# EasyEDA Pro project ProProject_Hauptplatine_ESP32.epro, board PCB1_kombi
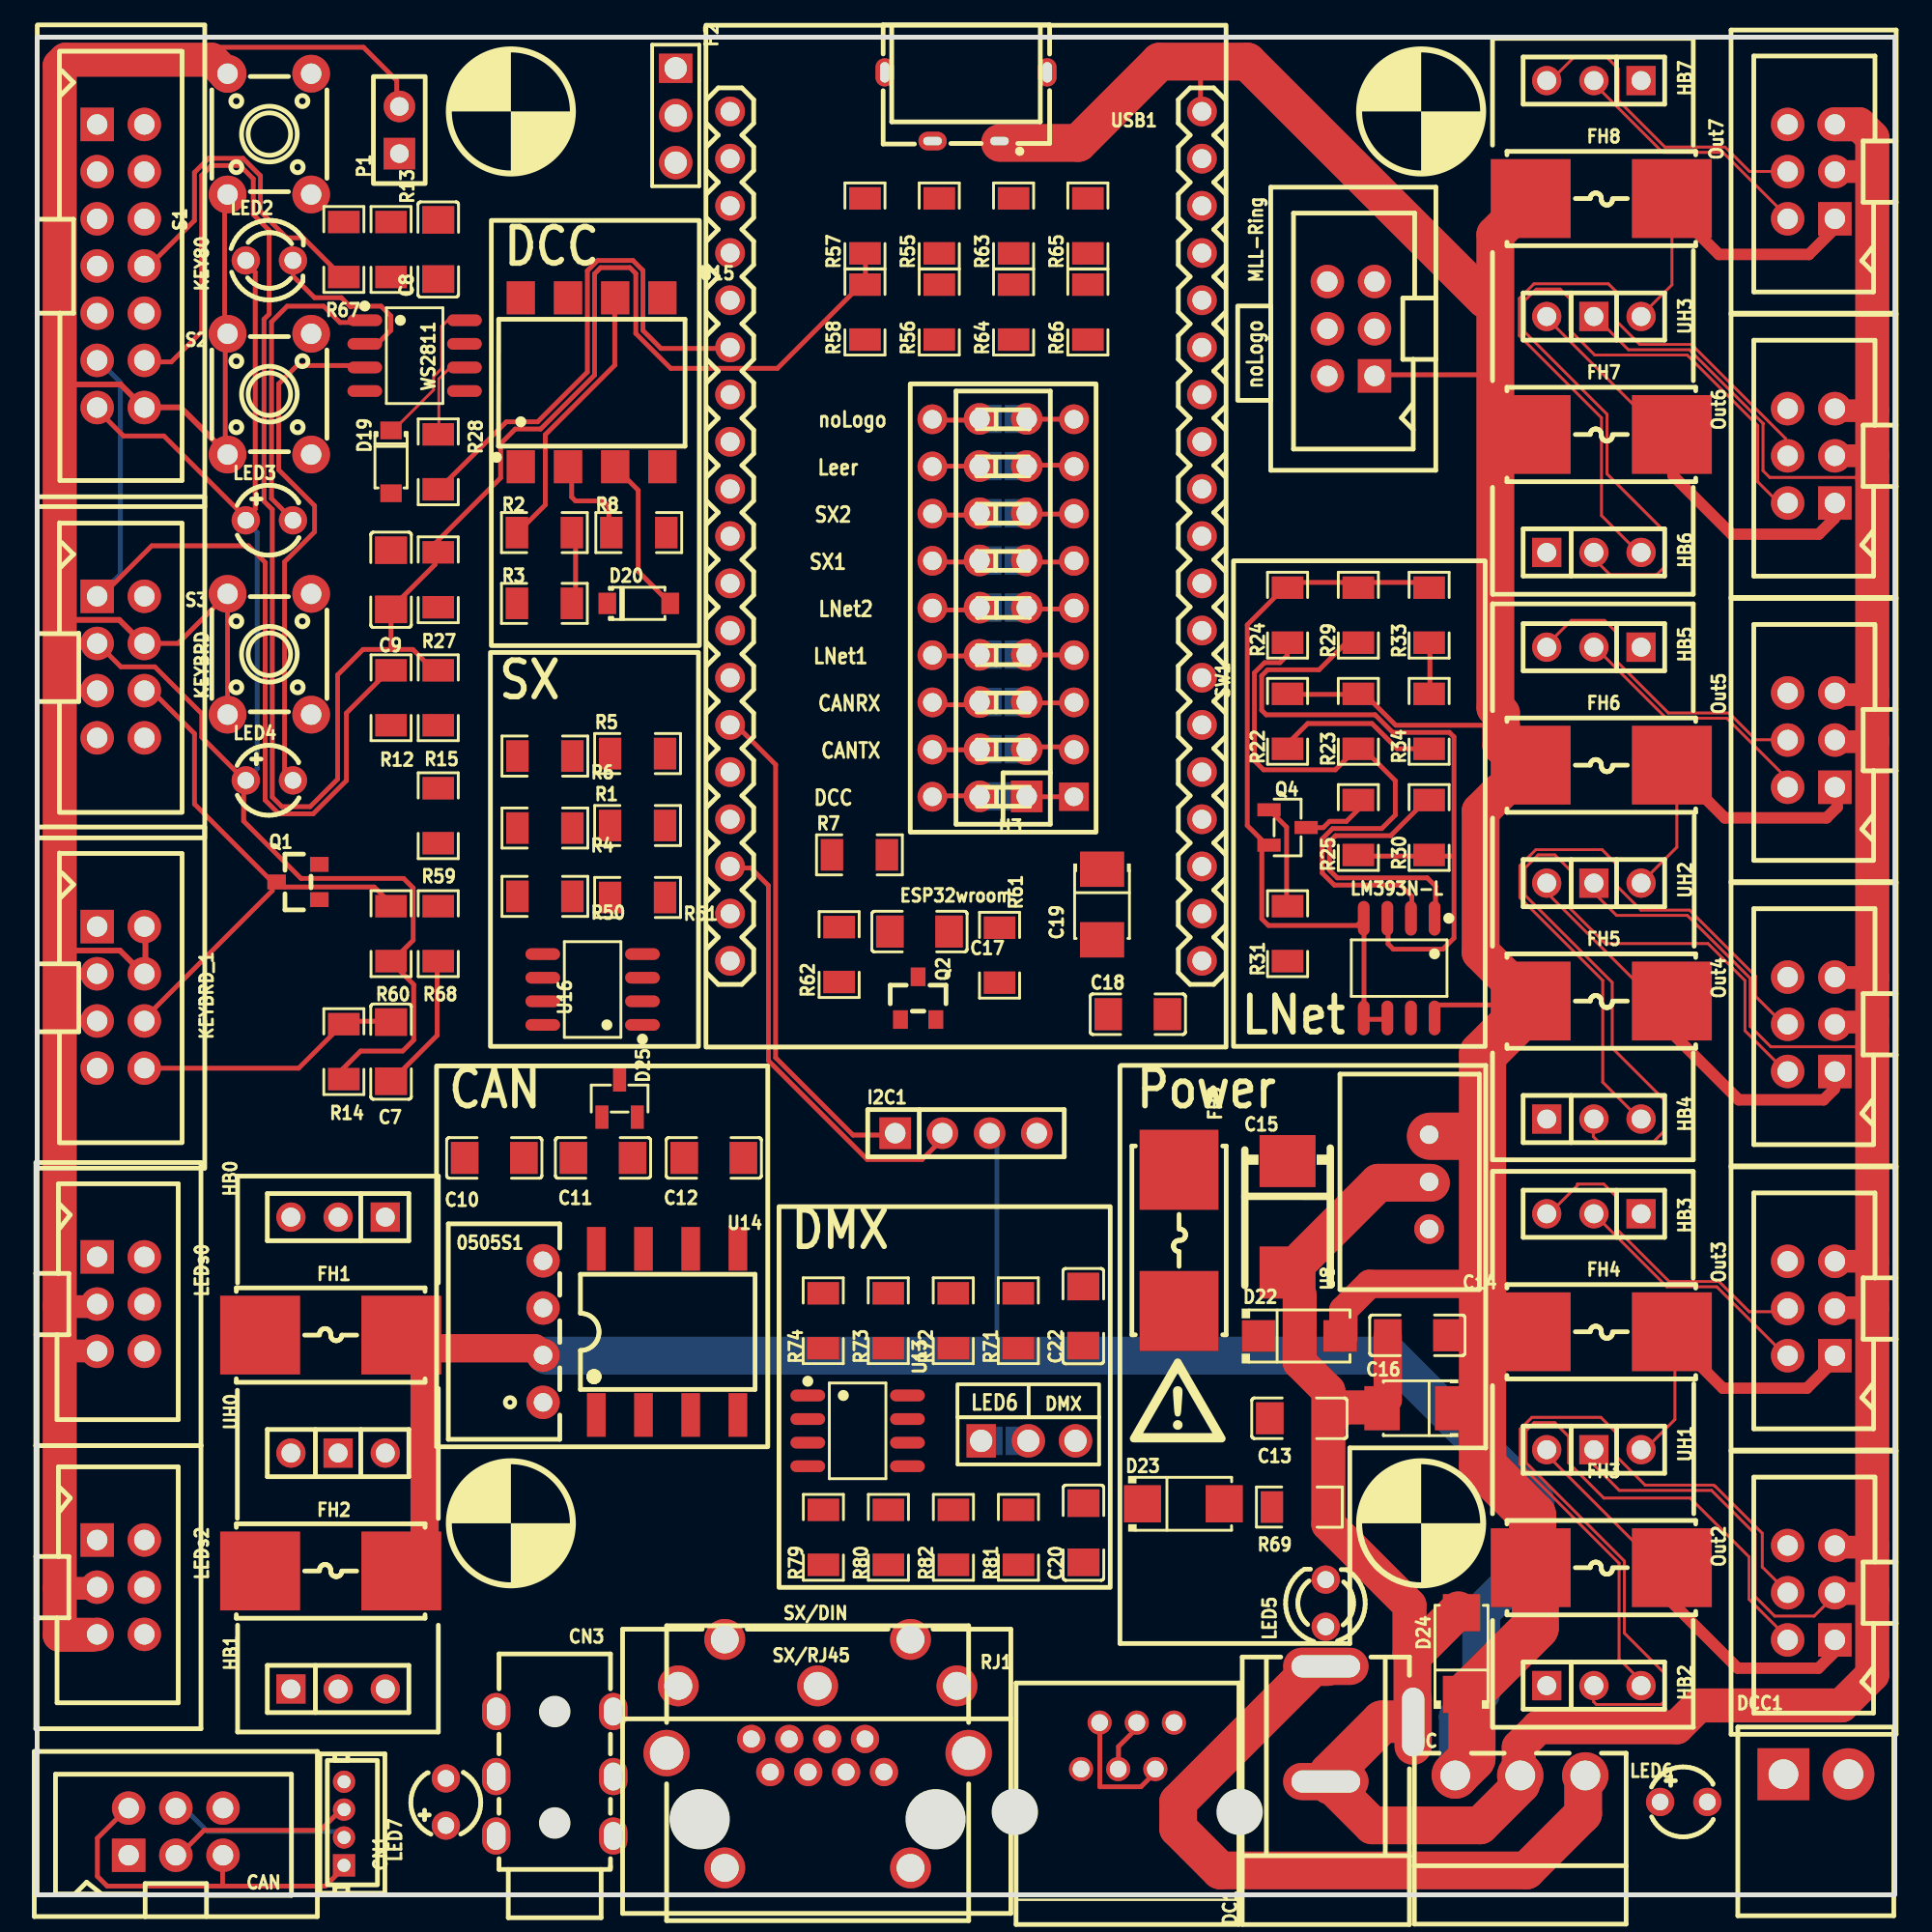
[diagram p14: board, top side]
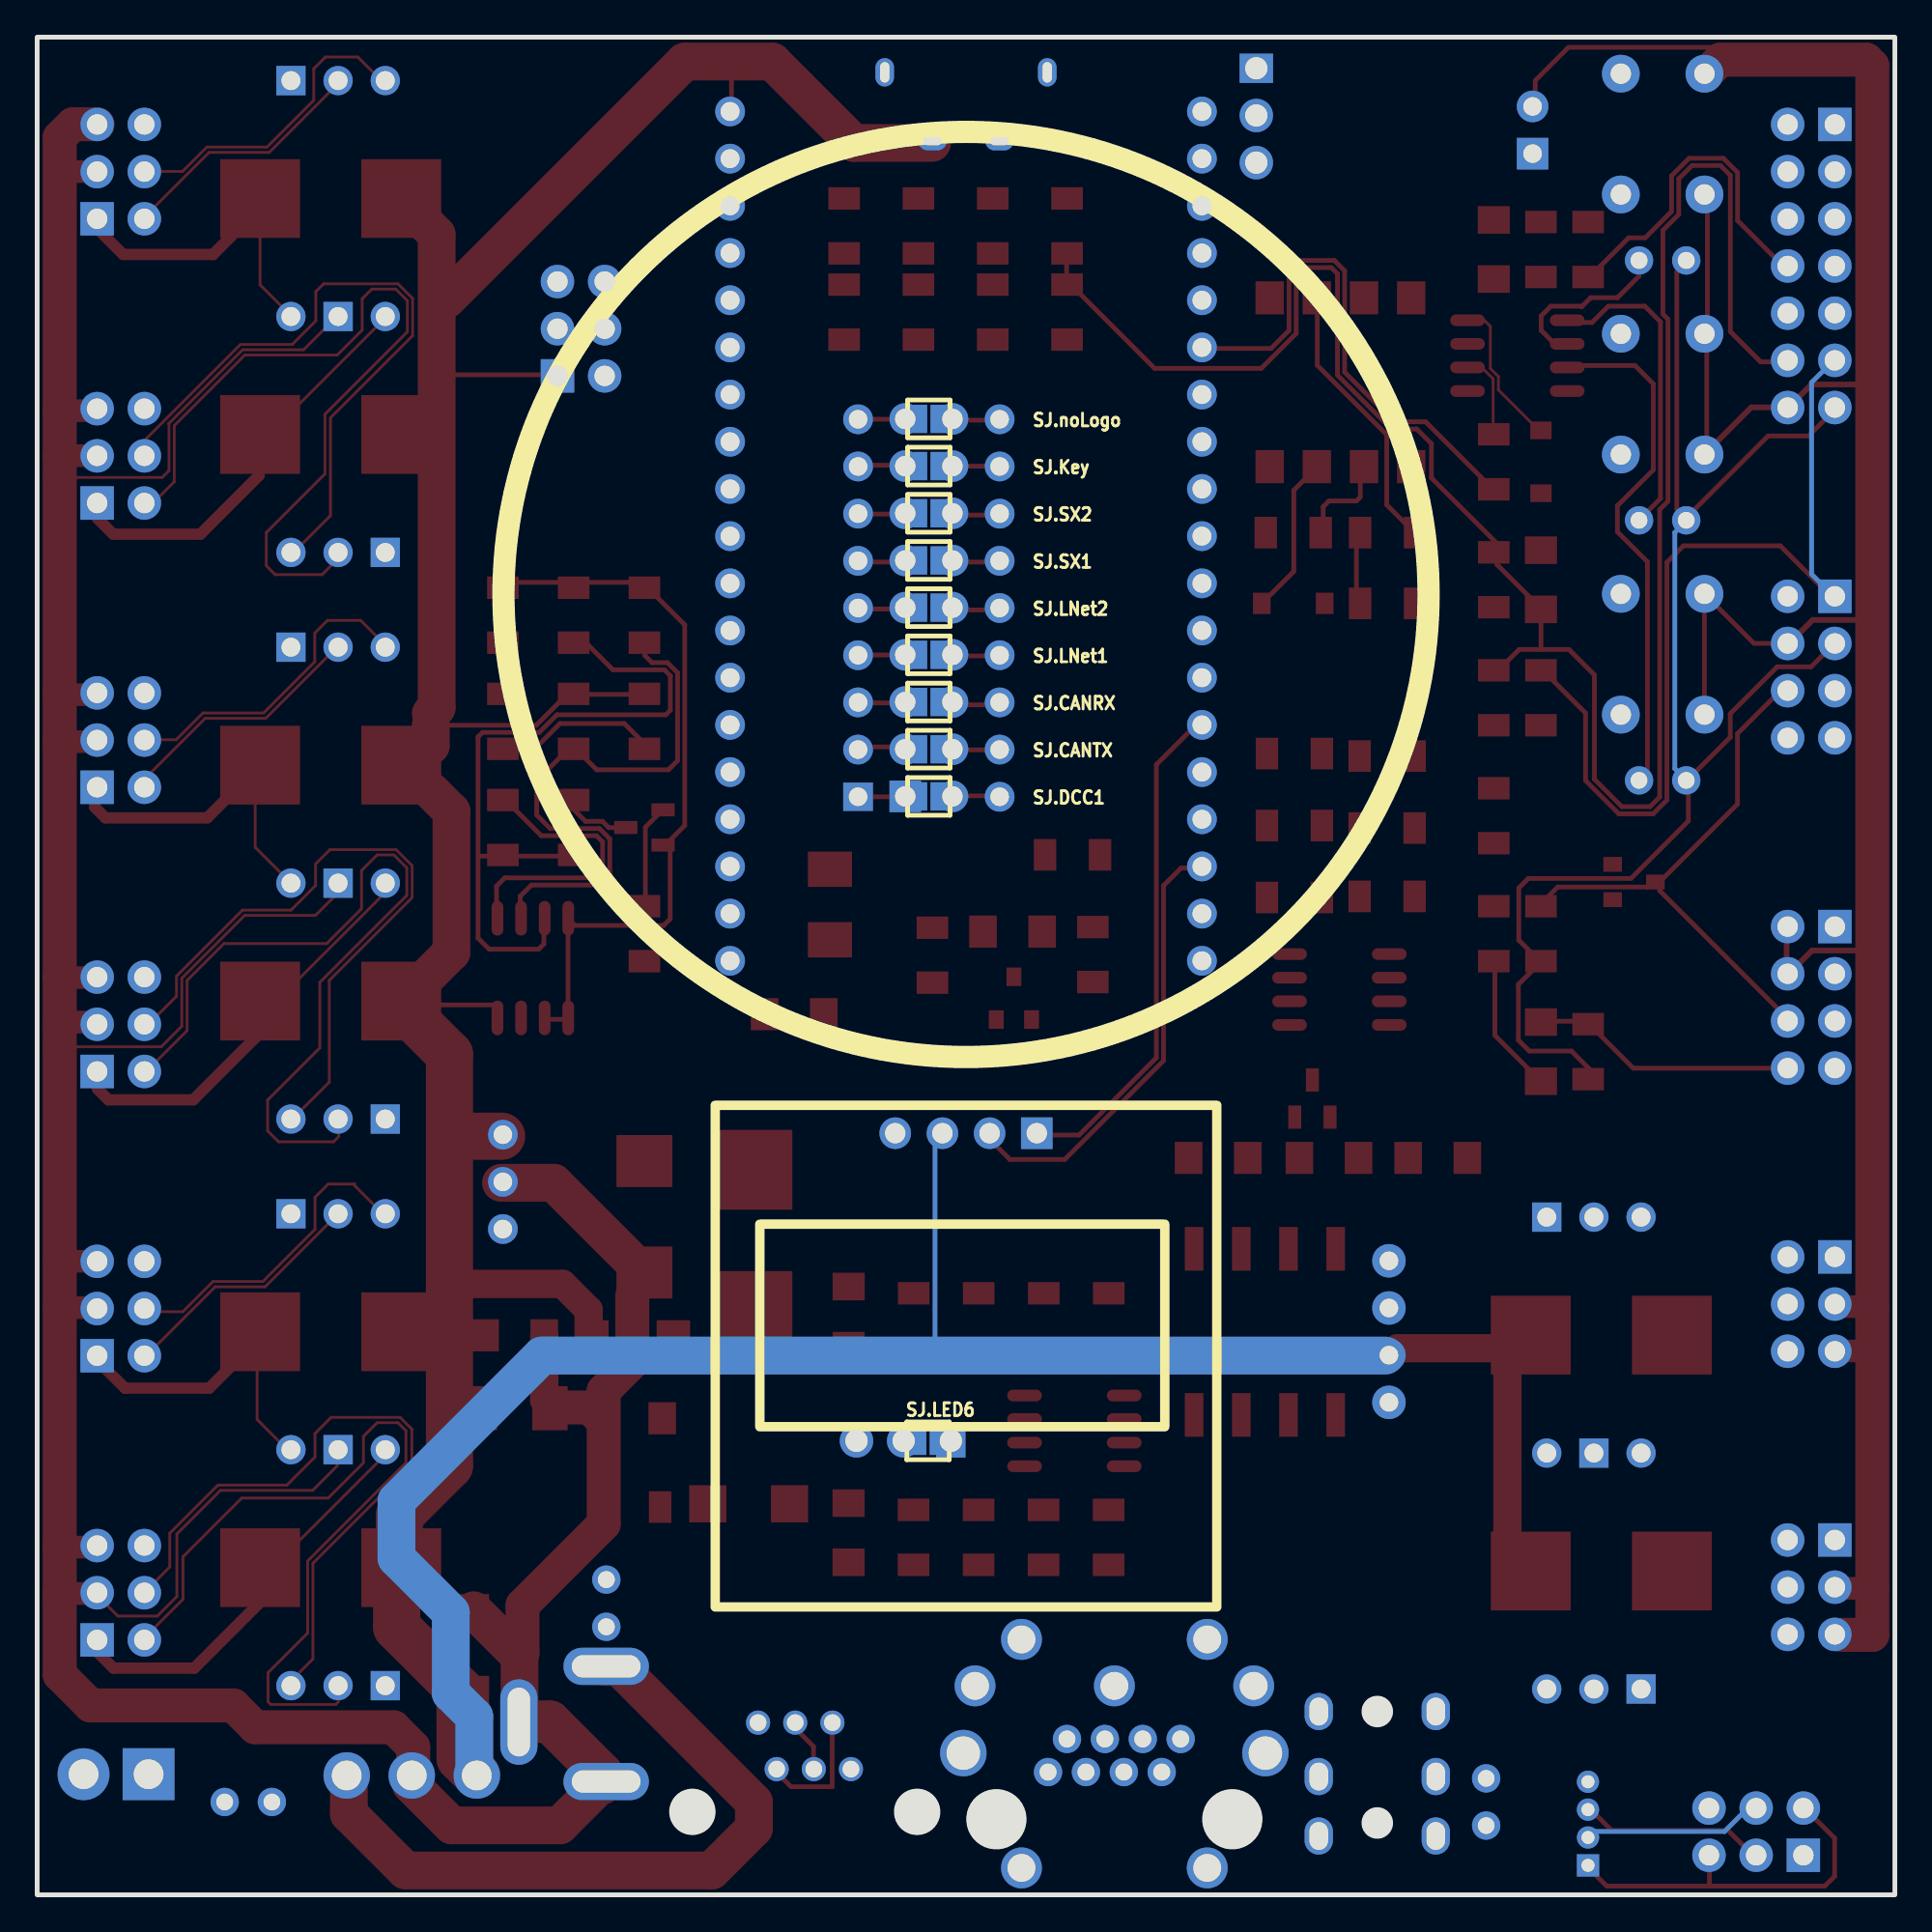
[diagram p15: board, bottom side, seen from below]

Outline 100 x 100 mm; copper layers: Top Layer, Bottom Layer. Coordinates in mm from the lower left corner of the outline.
Outline path: rectangle 0,100 100,0
Stack: Top Layer 0.035mm / Dielectric1 1.51mm FR4 er 4.5 / Bottom Layer 0.035mm

## Design rules (mm)
template: copperThickness1oz
spacing copperThickness1oz (default): track to track 0.132, other pairs 0.152 to 0.3
spacing copperThickness2oz: track to track 0.203, other pairs 0.152 to 0.3
track width copperThickness1oz (default): min 0.127, default 0.254, max 2.54
track width copperThickness2oz: min 0.203, default 0.254, max 2.54
differential pair differentialPair (default): width min 0.127, default 0.254, max 2.54; gap min 0.152, default 0.152
via viaSize (default): diameter min 0.5, default 0.61, max 10; hole min 0.3, default 0.305, max 6.299

## Placement (name value [footprint] x y rotation side)
0505S1  B0505S-W5R3  [PWRM-TH_BXXXXS-1WR3]  27.23 30.32 90 top
C7  1uF  [C1206]  19.05 45.39 90 top
C8  1uF  [C1206]  21.59 88.57 90 top
C9  1uF  [C1206]  19.05 70.79 90 top
C10  4.7uF  [C1206]  24.61 39.67 180 top
C11  4.7uF  [C1206]  30.46 39.67 180 top
C12  100nF  [C1206]  36.42 39.67 180 top
C13  100nF  [C1206]  67.94 25.65 180 top
C14  100nF  [C1206]  74.29 30.12 0 top
C15  100uF  [CASE-D_7343]  67.31 36.5 90 top
C16  100uF  [CAP-SMD_L3.5-W2.8-R-RD]  74.29 26.2 0 top
C17  1uF  [C1206]  47.5 51.85 180 top
C18  100nF  [C1206]  59.25 47.4 0 top
C19  100uF  [CAP-SMD_L3.5-W2.8-R-RD]  57.32 53.31 90 top
C20  1uF  [C1206]  56.32 19.49 90 top
C22  10uF  [C1206]  56.31 31.15 90 top
CAN  BH254V-6P  [IDC-TH_6P-P2.54-V-R2-C3-S2.54]  7.47 3.4 0 top
CN1  B4B-ZR-3.4(LF)(SN)  [CONN-TH_B4B-ZR-3.4-LF-SN]  16.52 3.84 270 top
CN3  PJ-3136-B  [AUDIO-TH_PJ-3136-B]  27.86 6.52 90 top
D19  1N5819W  [SOD-123_L2.8-W1.8-LS3.7-RD]  19.05 77.14 270 top
D20  1N5819W  [SOD-123_L2.8-W1.8-LS3.7-RD]  32.38 69.52 0 top
D22  1N5819  [SMA_L4.4-W2.6-LS5.0-RD]  67.94 30.08 0 top
D23  SS52  [SMA_L4.3-W2.6-LS5.1-R-RD]  61.7 21.05 0 top
D24  SS52  [SMA_L4.3-W2.6-LS5.1-R-RD]  76.67 12.99 90 top
D25  PESD2CAN,215  [SOT-23-3_L2.9-W1.3-P1.90-LS2.4-BR]  31.35 42.86 270 top
DC  DB2ERC-3.5-3P-GN  [CONN-TH_3P-P3.50_DB2ERC-3.5-3P-GN]  79.84 6.43 0 top
DC1  DC005  [DC-IN-TH_DC005]  71.72 9.2 90 top
DCC1  DB2ERC-3.5-2P-GN  [CONN-TH_2P-P3.50_DB2ERC-3.5-2P]  95.75 6.49 0 top
DMX  2.54-1*3P针  [HDR-TH_3P-P2.54-V-M-1]  53.36 24.44 0 top
ESP32wroom  ESP32-DevKitC  [buletm-smd_esp32-devkitc]  50 73.14 90 top
FH1  01550900M  [FUSE-SMD_L9.8-W5.0]  15.8 30.13 180 top
FH2  01550900M  [FUSE-SMD_L9.8-W5.0]  15.8 17.43 180 top
FH3  01550900M  [FUSE-SMD_L9.8-W5.0]  84.2 17.61 0 top
FH4  01550900M  [FUSE-SMD_L9.8-W5.0]  84.2 30.31 0 top
FH5  01550900M  [FUSE-SMD_L9.8-W5.0]  84.2 48.11 0 top
FH6  01550900M  [FUSE-SMD_L9.8-W5.0]  84.2 60.81 0 top
FH7  01550900M  [FUSE-SMD_L9.8-W5.0]  84.2 78.61 0 top
FH8  01550900M  [FUSE-SMD_L9.8-W5.0]  84.2 91.31 0 top
FH9  01550900M  [FUSE-SMD_L9.8-W5.0]  61.47 35.23 90 top
H2  2.54-1*3P针  [HDR-TH_3P-P2.54-V-M-1]  34.37 95.78 270 top
H3  X6521WV-2x09H-C60D30  [hdr-th_18p-p2.54-v-m-r2-c9-s2.54]  52 69.29 90 top
HB0  PM2.54-1*3  [HDR-TH_3P-P2.54-V-F]  16.2 36.48 180 top
HB1  PM2.54-1*3  [HDR-TH_3P-P2.54-V-F]  16.2 11.08 0 top
HB2  PM2.54-1*3  [HDR-TH_3P-P2.54-V-F]  83.8 11.26 0 top
HB3  PM2.54-1*3  [HDR-TH_3P-P2.54-V-F]  83.8 36.66 180 top
HB4  PM2.54-1*3  [HDR-TH_3P-P2.54-V-F]  83.8 41.76 0 top
HB5  PM2.54-1*3  [HDR-TH_3P-P2.54-V-F]  83.8 67.16 180 top
HB6  PM2.54-1*3  [HDR-TH_3P-P2.54-V-F]  83.8 72.26 0 top
HB7  PM2.54-1*3  [HDR-TH_3P-P2.54-V-F]  83.8 97.66 180 top
I2C1  2.54-1*4P母  [HDR-TH_4P-P2.54-V-F]  50 41 0 top
KEY80  KEY80  [IDC-TH_14P-P2.54-V-R2-C7-S2.54]  4.5 87.68 270 top
KEYBRD  KEYBRD  [IDC-TH_8P-P2.54-V-R2-C4-S2.54]  4.5 66.09 270 top
KEYBRD_1  KEYBRD_1  [IDC-TH_8P-P2.54-V-R2-C4-S2.54]  4.5 48.31 270 top
LED2  gelb  [LED-TH_BD3.0-P2.54-FD_YELLOW]  12.5 87.98 0 top
LED3  weiss  [LED-TH_BD3.8-P2.54-FD_WHITE]  12.5 73.99 0 top
LED4  blau  [LED-TH_BD3.8-P2.54-FD_BLUE]  12.5 59.99 0 top
LED5  +12V  [LED-TH_BD3.0-P2.54-FD-GREEN]  69.36 15.7 90 top
LED6  blau  [LED-TH_BD3.8-P2.54-FD_BLUE]  88.63 5 0 top
LED7  blau  [LED-TH_BD3.8-P2.54-FD_BLUE]  22 5 90 top
LEDs0  BH254V-6P  [IDC-TH_6P-P2.54-V-R2-C3-S2.54]  4.5 31.8 270 top
LEDs2  BH254V-6P  [IDC-TH_6P-P2.54-V-R2-C3-S2.54]  4.5 16.56 270 top
LM393N-L  LM393  [SOP-8_L4.9-W3.9-P1.27-LS6.0-BL]  73.32 49.89 180 top
MLL-Ring  BH254V-6P  [IDC-TH_6P-P2.54-V-R2-C3-S2.54]  70.72 84.31 90 top
Out2  BH254V-6P  [IDC-TH_6P-P2.54-V-R2-C3-S2.54]  95.5 16.26 90 top
Out3  BH254V-6P  [IDC-TH_6P-P2.54-V-R2-C3-S2.54]  95.5 31.56 90 top
Out4  BH254V-6P  [IDC-TH_6P-P2.54-V-R2-C3-S2.54]  95.5 46.86 90 top
Out5  BH254V-6P  [IDC-TH_6P-P2.54-V-R2-C3-S2.54]  95.5 62.16 90 top
Out6  BH254V-6P  [IDC-TH_6P-P2.54-V-R2-C3-S2.54]  95.5 77.46 90 top
Out7  BH254V-6P  [IDC-TH_6P-P2.54-V-R2-C3-S2.54]  95.5 92.76 90 top
P1  LDR  [HDR-TH_2P-P2.54-V-F]  19.5 95 90 top
Q1  BS170FTA  [SOT-23_L2.9-W1.3-P1.90-LS2.4-BR]  14.04 54.52 0 top
Q2  BS170FTA  [SOT-23_L2.9-W1.3-P1.90-LS2.4-BR]  47.42 48.27 270 top
Q4  BC847  [SOT-23-3_L2.9-W1.3-P1.90-LS2.4-BR]  67.31 57.46 180 top
R1  22kΩ  [R1206]  32.32 57.56 0 top
R2  1kΩ  [R1206]  27.31 73.33 0 top
R3  270Ω  [R1206]  27.31 69.52 180 top
R4  8.2kΩ  [R1206]  27.33 57.43 180 top
R5  22kΩ  [R1206]  32.32 61.44 0 top
R6  8.2kΩ  [R1206]  27.33 61.3 180 top
R7  4.7kΩ  [R1206]  44.26 55.98 0 top
R8  1kΩ  [R1206]  32.38 73.33 180 top
R12  100Ω  [R1206]  19.05 64.44 270 top
R13  4.7kΩ  [R1206]  19.05 88.57 270 top
R14  22kΩ  [R1206]  16.51 45.39 90 top
R15  100Ω  [R1206]  21.59 64.44 90 top
R22  8.2kΩ  [R1206]  67.31 63.17 270 top
R23  10kΩ  [R1206]  71.12 63.17 90 top
R24  22kΩ  [R1206]  67.31 68.89 270 top
R25  47kΩ  [R1206]  71.12 57.45 90 top
R27  22kΩ  [R1206]  21.59 70.79 90 top
R28  100Ω  [R1206]  21.59 77.14 270 top
R29  150kΩ  [R1206]  71.12 68.89 270 top
R30  220kΩ  [R1206]  74.93 57.45 270 top
R31  10kΩ  [R1206]  67.31 51.74 90 top
R33  2kΩ  [R1206]  74.93 68.89 270 top
R34  1kΩ  [R1206]  74.93 63.17 90 top
R50  33kΩ  [R1206]  27.33 53.75 180 top
R51  33kΩ  [R1206]  32.32 53.69 180 top
R55  1kΩ  [R1206]  48.56 89.84 90 top
R56  2kΩ  [R1206]  48.56 85.2 90 top
R57  1kΩ  [R1206]  44.56 89.84 90 top
R58  2kΩ  [R1206]  44.56 85.2 90 top
R59  1kΩ  [R1206]  21.59 58.09 90 top
R60  1kΩ  [R1206]  19.05 51.74 90 top
R61  1kΩ  [R1206]  51.81 50.58 270 top
R62  1kΩ  [R1206]  43.17 50.62 90 top
R63  100kΩ  [R1206]  52.56 89.84 90 top
R64  220kΩ  [R1206]  52.56 85.2 90 top
R65  100kΩ  [R1206]  56.56 89.84 90 top
R66  220kΩ  [R1206]  56.56 85.2 90 top
R67  1kΩ  [R1206]  16.51 88.57 90 top
R68  2kΩ  [R1206]  21.59 51.74 90 top
R69  10kΩ  [R1206]  67.94 20.88 180 top
R71  10kΩ  [R1206]  52.81 30.9 90 top
R72  10kΩ  [R1206]  49.31 30.9 90 top
R73  10kΩ  [R1206]  45.81 30.9 90 top
R74  10kΩ  [R1206]  42.31 30.9 90 top
R79  20kΩ  [R1206]  42.32 19.25 90 top
R80  20kΩ  [R1206]  45.82 19.25 90 top
R81  1kΩ  [R1206]  52.82 19.25 90 top
R82  120Ω  [R1206]  49.32 19.25 90 top
RJ1  DS1133-S60BPX  [RJ11-TH_DS1133-S60BPX]  58.69 8.02 90 top
S1  K2-1102DP-X4SW-04  [KEY-TH_4P-L6.2-W6.2-P4.50-LS6.5]  12.5 94.78 90 top
S2  K2-1102DP-X4SW-04  [KEY-TH_4P-L6.2-W6.2-P4.50-LS6.5]  12.5 80.78 90 top
S3  K2-1102DP-X4SW-04  [KEY-TH_4P-L6.2-W6.2-P4.50-LS6.5]  12.5 66.78 90 top
SJ.CANRX  SJ_1.27  [SMD_2P-P1.27-SJ]  52 64.21 180 bottom
SJ.CANTX  SJ_1.27  [SMD_2P-P1.27-SJ]  52 61.67 180 bottom
SJ.DCC1  SJ_1.27  [SMD_2P-P1.27-SJ]  52 59.13 180 bottom
SJ.Key  SJ_1.27  [SMD_2P-P1.27-SJ]  52 76.91 180 bottom
SJ.LED6  SJ_1.27  [SMD_2P-P1.27-SJ]  52.05 24.44 180 bottom
SJ.LNet1  SJ_1.27  [SMD_2P-P1.27-SJ]  52 66.75 180 bottom
SJ.LNet2  SJ_1.27  [SMD_2P-P1.27-SJ]  52 69.29 180 bottom
SJ.noLogo  SJ_1.27  [SMD_2P-P1.27-SJ]  52 79.45 180 bottom
SJ.SX1  SJ_1.27  [SMD_2P-P1.27-SJ]  52 71.83 180 bottom
SJ.SX2  SJ_1.27  [SMD_2P-P1.27-SJ]  52 74.37 180 bottom
SW1  DS-09RP  [SW-TH_18P-L24.4-W9.9-P2.54-LS7.6]  52 69.27 180 top
SX/DIN  DIN-504B-M10  [conn-th_din-504b-m10]  42.01 7.6 0 top
SX/RJ45  R-RJ45R08P-B000  [RJ45-TH_R-RJ45R08P-B000]  42.01 7.5 0 top
U8  LC78_05-3.0  [PWRM-TH_LC78_05-3.0]  74.93 38.38 90 top
U13  max485ESA  [SOP-8_L4.9-W3.9-P1.27-LS6.0-BL]  44.17 24.98 270 top
U14  ISO1050DUBR  [SOIC-8_L9.3-W6.6-P2.54-LS10.4-BL]  33.91 30.3 0 top
U15  6N137S  [SOP-8_L9.8-W6.6-P2.54-LS10.3-BL]  29.84 81.42 0 top
U16  LM393  [SOP-8_L4.9-W3.9-P1.27-LS6.0-BL]  29.9 48.73 90 top
UH0  PM2.54-1*3  [hdr-th_3p-p2.54-v-f]  16.2 23.78 0 top
UH1  PM2.54-1*3  [hdr-th_3p-p2.54-v-f]  83.8 23.96 0 top
UH2  PM2.54-1*3  [hdr-th_3p-p2.54-v-f]  83.8 54.46 0 top
UH3  PM2.54-1*3  [hdr-th_3p-p2.54-v-f]  83.8 84.96 0 top
USB1  KH-TYPE-C-2P  [USB-SMD_KH-TYPE-C-2P]  50 96.26 180 top
WS2811  WS2811  [SOP-8_L4.9-W3.9-P1.27-LS6.0-BL]  20.32 82.86 270 top

## Footprints (pads in the part's own frame, mm; a bottom-side part is the same pattern mirrored in y, then rotated)
AUDIO-TH_PJ-3136-B
  oval 2x1.524 hole 1.5x1: 2(-3.35,3.15) 2(-3.35,-3.15) 3(-0.15,3.15) 3(-0.15,-3.15) 4(3.35,3.15) 4(3.35,-3.15)
buletm-smd_esp32-devkitc
  round 1.6 hole 1.02: 1(-22.86,-12.7) 2(-20.32,-12.7) 3(-17.78,-12.7) 4(-15.24,-12.7) 5(-12.7,-12.7) 6(-10.16,-12.7) 7(-7.62,-12.7) 8(-5.08,-12.7) 9(-2.54,-12.7) 10(0,-12.7) 11(2.54,-12.7) 12(5.08,-12.7) 13(7.62,-12.7) 14(10.16,-12.7) 15(12.7,-12.7) 16(15.24,-12.7) 17(17.78,-12.7) 18(20.32,-12.7) 19(22.86,-12.7) 20(-22.86,12.7) 21(-20.32,12.7) 22(-17.78,12.7) 23(-15.24,12.7) 24(-12.7,12.7) 25(-10.16,12.7) 26(-7.62,12.7) 27(-5.08,12.7) 28(-2.54,12.7) 29(0,12.7) 30(2.54,12.7) 31(5.08,12.7) 32(7.62,12.7) 33(10.16,12.7) 34(12.7,12.7) 35(15.24,12.7) 36(17.78,12.7) 37(20.32,12.7) 38(22.86,12.7)
C1206
  rect 1.485x1.728 smd: 1(-1.593,0) 2(1.593,0)
CAP-SMD_L3.5-W2.8-R-RD
  rect 1.9x2.376 smd: 1(1.899,0) 2(-1.899,0)
CASE-D_7343
  rect 2.799x3.01 smd: 1(3,0) 2(-3,0)
CONN-TH_2P-P3.50_DB2ERC-3.5-2P
  round 2.794 hole 1.6: 1(1.75,0)
  rect 2.794x2.794 hole 1.6: 2(-1.75,0)
CONN-TH_3P-P3.50_DB2ERC-3.5-3P-GN
  round 2.5 hole 1.6: 1(-3.5,0) 2(0,0) 3(3.5,0)
CONN-TH_B4B-ZR-3.4-LF-SN
  rect 1.2x1.2 hole 0.7: 1(2.25,0)
  round 1.2 hole 0.7: 2(0.75,-0.002) 3(-0.75,0.002) 4(-2.25,0.002)
conn-th_din-504b-m10
  round 2.2 hole 1.5: 1(-7.5,3.65) 2(0,3.65) 3(7.5,3.65) 4(-5,6.15) 5(5,6.15) 6(-5,-6.15) 7(5,-6.15)
DC-IN-TH_DC005
  oval 2x4.6 hole 1.2x3.7: 1(3.1,2.35) 2(-3.1,2.35)
  oval 4.6x2 hole 3.7x1.2: 3(0.1,-2.35)
FUSE-SMD_L9.8-W5.0
  rect 4.3x4.24 smd: 1(-3.8,0) 2(3.8,0)
HDR-TH_2P-P2.54-V-F
  rect 1.7x1.7 hole 1: 1(-1.27,0)
  round 1.7 hole 1: 2(1.27,0)
hdr-th_3p-p2.54-v-f
  round 1.575 hole 1.02: 1(-2.54,0) 3(2.54,0)
  rect 1.575x1.575 hole 1.02: 2(0,0)
HDR-TH_3P-P2.54-V-F
  rect 1.575x1.575 hole 1.02: 1(-2.54,0)
  round 1.575 hole 1.02: 2(0,0) 3(2.54,0)
HDR-TH_3P-P2.54-V-M-1
  rect 1.575x1.8 hole 1.2: 1(-2.54,0)
  round 1.8 hole 1.2: 2(0,0) 3(2.54,0)
HDR-TH_4P-P2.54-V-F
  rect 1.7x1.7 hole 1.1: 1(-3.81,0)
  round 1.7 hole 1.1: 2(-1.27,0) 3(1.27,0) 4(3.81,0)
hdr-th_18p-p2.54-v-m-r2-c9-s2.54
  rect 1.7x1.7 hole 1.1: 1(-10.16,-1.27)
  round 1.7 hole 1.1: 2(-7.62,-1.27) 3(-5.08,-1.27) 4(-2.54,-1.27) 5(0,-1.27) 6(2.54,-1.27) 7(5.08,-1.27) 8(7.62,-1.27) 9(10.16,-1.27) 10(10.16,1.27) 11(7.62,1.27) 12(5.08,1.27) 13(2.54,1.27) 14(0,1.27) 15(-2.54,1.27) 16(-5.08,1.27) 17(-7.62,1.27) 18(-10.16,1.27)
IDC-TH_6P-P2.54-V-R2-C3-S2.54
  rect 1.8x1.8 hole 1.1: 1(-2.54,-1.27)
  round 1.8 hole 1.1: 2(-2.54,1.27) 3(0,-1.27) 4(0,1.27) 5(2.54,-1.27) 6(2.54,1.27)
IDC-TH_8P-P2.54-V-R2-C4-S2.54
  rect 1.801x1.801 hole 1.1: 1(-3.81,-1.27)
  round 1.801 hole 1.1: 2(-3.81,1.27) 3(-1.27,-1.27) 4(-1.27,1.27) 5(1.27,-1.27) 6(1.27,1.27) 7(3.81,-1.27) 8(3.81,1.27)
IDC-TH_14P-P2.54-V-R2-C7-S2.54
  rect 1.8x1.8 hole 1.1: 1(-7.62,-1.27)
  round 1.8 hole 1.1: 2(-7.62,1.27) 3(-5.08,-1.27) 4(-5.08,1.27) 5(-2.54,-1.27) 6(-2.54,1.27) 7(0,-1.27) 8(0,1.27) 9(2.54,-1.27) 10(2.54,1.27) 11(5.08,-1.27) 12(5.08,1.27) 13(7.62,-1.27) 14(7.62,1.27)
KEY-TH_4P-L6.2-W6.2-P4.50-LS6.5
  round 2.032 hole 1.1: 1(-3.251,2.251) 2(3.251,2.251) 3(-3.251,-2.251) 4(3.251,-2.251)
LED-TH_BD3.0-P2.54-FD-GREEN
  round 1.524 hole 0.914: 1(-1.27,0) 2(1.27,0)
LED-TH_BD3.0-P2.54-FD_YELLOW
  round 1.524 hole 0.914: 1(-1.27,0) 2(1.27,0)
LED-TH_BD3.8-P2.54-FD_BLUE
  round 1.524 hole 0.9: 1(-1.27,0) 2(1.27,0)
LED-TH_BD3.8-P2.54-FD_WHITE
  round 1.524 hole 0.9: 1(-1.27,0) 2(1.27,0)
PWRM-TH_BXXXXS-1WR3
  round 1.8 hole 1: 1(-3.81,0) 2(-1.27,0) 3(1.27,0) 4(3.81,0)
PWRM-TH_LC78_05-3.0
  round 1.6 hole 1: 1(-2.54,0) 2(0,0) 3(2.54,0)
R1206
  rect 1.208x1.701 smd: 1(-1.479,0) 2(1.479,0)
RJ11-TH_DS1133-S60BPX
  round 1.3 hole 0.9: 1(1.251,-2.499) 2(-1.251,-1.498) 3(1.251,-0.5) 4(-1.251,0.5) 5(1.251,1.501) 6(-1.251,2.499)
RJ45-TH_R-RJ45R08P-B000
  round 1.524 hole 0.914: 1(3.57,-0.89) 2(2.55,0.89) 3(1.53,-0.89) 4(0.51,0.89) 5(-0.51,-0.89) 6(-1.53,0.89) 7(-2.55,-0.89) 8(-3.57,0.89)
  round 2.5 hole 1.8: 9(-8.13,0.13) 10(8.13,0.13)
SMA_L4.3-W2.6-LS5.1-R-RD
  rect 2x2 smd: 1(2.2,0) 2(-2.2,0)
SMA_L4.4-W2.6-LS5.0-RD
  rect 1.8x1.7 smd: 1(-2.192,0) 2(2.192,0)
SMD_2P-P1.27-SJ
  rect 0.762x1.524 smd: 1(-0.47,0) 2(0.47,0)
SOD-123_L2.8-W1.8-LS3.7-RD
  rect 0.95x1.15 smd: 1(-1.692,0) 2(1.692,0)
SOIC-8_L9.3-W6.6-P2.54-LS10.4-BL
  rect 1x2.35 smd: 1(-3.81,-4.471) 2(-1.27,-4.471) 3(1.27,-4.471) 4(3.81,-4.471) 5(3.81,4.471) 6(1.27,4.471) 7(-1.27,4.471) 8(-3.81,4.471)
SOP-8_L4.9-W3.9-P1.27-LS6.0-BL
  oval 0.63x1.865 smd: 1(-1.905,-2.683) 2(-0.635,-2.683) 3(0.635,-2.683) 4(1.905,-2.683) 5(1.905,2.683) 6(0.635,2.683) 7(-0.635,2.683) 8(-1.905,2.683)
SOP-8_L9.8-W6.6-P2.54-LS10.3-BL
  rect 1.525x1.78 smd: 1(-3.81,-4.545) 2(-1.27,-4.545) 3(1.27,-4.545) 4(3.81,-4.545) 5(3.81,4.545) 6(1.27,4.545) 7(-1.27,4.545) 8(-3.81,4.545)
SOT-23-3_L2.9-W1.3-P1.90-LS2.4-BR
  rect 1.25x0.7 smd: 1(1,-0.95) 2(1,0.95) 3(-1,0)
SOT-23_L2.9-W1.3-P1.90-LS2.4-BR
  rect 1x0.8 smd: 1(1.15,-0.95) 2(1.15,0.95) 3(-1.15,0)
SW-TH_18P-L24.4-W9.9-P2.54-LS7.6
  rect 1.6x1.524 hole 1: 1(-3.81,10.16)
  round 1.6 hole 1: 2(-3.81,7.62) 3(-3.81,5.08) 4(-3.81,2.54) 5(-3.81,0) 6(-3.81,-2.54) 7(-3.81,-5.08) 8(-3.81,-7.62) 9(-3.81,-10.16) 10(3.81,-10.16) 11(3.81,-7.62) 12(3.81,-5.08) 13(3.81,-2.54) 14(3.81,0) 15(3.81,2.54) 16(3.81,5.08) 17(3.81,7.62) 18(3.81,10.16)
USB-SMD_KH-TYPE-C-2P
  oval 1.524x1 hole 1x0.45: 1(-1.8,1.85) 2(1.8,1.85)
  oval 1x1.524 hole 0.5x1.1: 3(4.375,-1.85) 4(-4.375,-1.85)

## Nets
As in the schematic.

Pads without a net: CAN 1 6; CN1 4; ESP32wroom 16 17 18 23 24 36 37 38; LM393N-L 7; MLL-Ring 6; RJ1 1 6; SX/DIN 3 5 6 7; SX/RJ45 1 2 3 9 10; U15 1 4 7; USB1 3 4; WS2811 7

## Routing (per net, layer and track width the routed paths; a pad name or vN(x,y) marks a point on that pad's centre or on a via; arc(x,y) is an arc through that point)
+3V3: length 4
  Top Layer w0.254: 28.99,73.3 28.99,69.56 28.83,69.4
+5V: length 339.8
  Top Layer w0.254: 11.18,87.9 11.74,87.34 11.74,74.6 11.25,74.11 ; 71.06,64.62 71.47,64.62 73.13,62.96 78.81,62.96 ; 71.06,64.62 71.08,64.6 ; 71.06,64.62 67.43,64.62 ; 11.25,74.11 6.83,78.53 4.65,78.53 3.14,80.04 ; 11.25,74.11 11.25,74.07 ; 16.45,43.88 16.45,44.46 17.41,45.42 19.68,45.42 20.27,46.01 20.27,49 19.05,50.22 ; 71.89,81.83 78.32,81.83 78.37,81.88 ; 62.62,95.94 62.62,98.47 ; 3.24,67.37 4.51,66.11 6.33,66.11 8.86,63.58 8.86,62.31 11.07,60.1 ; 19.21,50.36 20.24,51.39 20.24,54.2 19.73,54.71 14.2,54.71 11.12,57.8 11.12,59.98 ; 75.22,47.9 79.22,47.9 ; 78.81,63.6 78.85,63.6
  Top Layer w1.016: 20.86,29.66 20.86,29.42 20.62,29.42
  Top Layer w1.219: 78.81,63.6 78.81,62.96
  Top Layer w1.524: 19.79,17.69 20.86,18.76 20.86,29.42 26.78,29.42 27.25,28.95 ; 77.69,32.78 77.58,32.89 71.72,32.89 70.31,31.48 70.31,30.01
  Top Layer w2.032: 77.95,85.88 65.14,98.68 60.42,98.68 56.04,94.31 51.83,94.31 ; 78.92,49.52 77.7,50.74 77.7,58.33 78.77,59.39 ; 80.03,60.66 78.81,61.87 78.81,62.96 ; 80.34,91.22 78.49,89.37 78.49,63.91 78.81,63.6
  Top Layer w2.54: 77.23,11 77.23,7.36 76.33,6.46 ; 77.23,11 77.07,10.83 ; 77.23,11 80.65,14.41 80.65,16.94 ; 80.34,48.02 80.34,47.78 77.81,45.24 77.81,23.11 80.5,20.41 80.5,17.77 ; 75,40.84 77.21,40.84
  Bottom Layer w0.254: 11.25,60.03 11.84,60.63 11.84,73.34 11.18,74 ; 51.2,40.95 51.67,40.48 51.67,29.11
  Bottom Layer w2.032: 76.47,6.44 76.47,9.6 77.73,10.86 77.73,15.21 80.66,18.13 80.66,21.21 72.84,29.03 27.42,29.03
GND: length 478.5
  Top Layer w0.152: 92.9,79.21 92.93,79.18 ; 92.9,79.21 88.94,83.17 85.65,83.17 83.84,84.99 ; 92.9,79.21 92.9,76.66 93.27,76.3 98.85,76.3 99.11,76.03 ; 83.84,24.01 83.84,23.1 85.17,21.77 90.13,21.77 92.48,19.43 92.48,16.06 93.53,15.01 95.65,15.01 96.82,16.17 ; 99.11,45.7 99.06,45.65 93.32,45.65 92.21,46.76 92.21,49.34 88.83,52.72 85.02,52.72 83.79,53.95 83.79,54.6 ; 99.09,18.75 99.12,18.78
  Top Layer w0.254: 18.93,43.67 21.53,46.26 21.53,50.36 ; 57.03,9.26 57.2,9.08 57.2,5.82 59.41,5.82 60.19,6.59 ; 10.09,91.4 10.09,83.97 9.98,83.87 ; 10.12,77.37 10.12,83.9 ; 72.66,47.13 71.45,47.13 71.38,47.2 71.42,47.25 71.42,52.7 ; 10.32,70.1 10.25,70.03 7.58,67.37 5.86,67.37 ; 19.36,96.45 19.36,97.66 17.57,99.45 8.4,99.45 8.35,99.51 ; 71.35,52.49 71.05,52.18 66.28,52.18 65.92,52.53 65.92,56.42 65.95,56.44 ; 66.25,56.45 65.14,57.56 65.14,68.36 67.43,70.65 74.9,70.65 ; 10.25,63.5 S3.2
  Top Layer w0.305: 5.83,52.1 5.83,49.67 5.76,49.6 ; 10.12,77.67 7.72,80.07 5.72,80.07 ; 1.05,68.63 4.42,68.63 5.69,67.37 ; 5.72,49.57 4.46,50.83 1.72,50.83 ; 1.47,81.3 4.49,81.3 5.72,80.07 ; 5.76,80.04 5.72,80.07 ; 5.72,80.07 5.65,80.07 ; 10.25,97.92 10.25,97.98
  Top Layer w0.914: 96.74,46.98 96.74,46.93 96.8,46.88
  Top Layer w1.219: 99.09,49.43 99.09,49.38 96.74,49.38 ; 96.79,18.72 99.05,18.72 99.09,18.75 ; 96.74,46.98 99,46.98 ; 96.77,64.6 99.09,64.6 99.09,64.84 ; 98.93,34.11 96.74,34.11 ; 99.07,79.89 96.74,79.89 ; 99.07,79.89 99.04,79.92 ; 99.07,79.89 99.09,79.89 ; 1.19,31.67 3.16,31.67 3.19,31.7 ; 96.72,34.11 96.74,34.11 ; 96.74,34.11 96.74,34.29 ; 98.76,16.22 96.81,16.22 ; 3.23,29.35 3.16,29.28 1.44,29.28 ; 96.74,49.38 96.74,49.46 ; 96.74,49.38 96.64,49.38 ; 3.23,16.64 3.09,16.5 1.05,16.5 ; 96.77,62.08 99.09,62.08 99.09,62.23 ; 98.88,31.61 96.74,31.61 ; 99.09,77.47 96.8,77.47 ; 98.61,92.66 98.5,92.77 96.82,92.77
  Top Layer w1.524: 72.31,26.25 72.7,26.64 72.7,30.11
  Top Layer w1.829: 98.76,15.96 98.79,15.94 98.79,11.85 97.13,10.2 89.43,10.2 88.26,9.02 80.81,9.02 ; 98.76,15.96 98.76,16.23 98.73,16.26 ; 98.76,15.96 98.69,16.22 98.79,16.32 98.79,18.62 98.69,18.72 98.79,18.82 98.79,31.61 98.79,34.11 98.79,94.6 98.07,95.31 96.74,95.31 ; 10.25,97.92 9.39,98.79 1.53,98.79 1.21,98.47 1.21,14 2.95,14 ; 80.81,9.01 79.76,7.96 79.76,6.11 ; 72.31,26.25 72.3,26.24 70.26,26.24 69.56,25.53 ; 67.96,32.29 67.96,28.67 69.5,27.13 69.5,19.96 73.87,15.59 73.87,13 74.03,12.84 74.03,10.05 ; 69.53,6 69.61,6
  Top Layer w2.032: 69.61,6 71.87,3.74 77.68,3.74 79.88,5.94 79.88,6.47 ; 75.03,38.33 72.19,38.33 68.19,34.33 ; 74.03,9 74.03,12.84 76.51,15.32
  Top Layer w2.286: 69.61,6 69.61,6.53 72.4,9.32 73.58,9.32 73.74,9.16
D4: length 7.8
  Top Layer w0.254: 50.79,64.11 50.74,64.06 48.16,64.06 ; 48.21,69.17 50.69,69.17 50.74,69.22 ; 50.79,74.22 50.74,74.27 48.21,74.27
D5: length 2.8
  Top Layer w0.254: 50.9,61.53 50.79,61.64 48.11,61.64
D13: length 8.1
  Top Layer w0.254: 48.21,66.69 50.79,66.69 50.9,66.8 ; 48.21,71.75 50.9,71.75 ; 50.74,59.11 50.69,59.16 48.11,59.16
LED7: length 2.6
  Top Layer w0.254: 48.21,79.38 50.79,79.38
SCL: length 24.2
  Top Layer w0.254: 48.63,40.9 48.63,40.58 47.63,39.58 44.68,39.58 39.37,44.9 39.37,54.33 38.42,55.28 37.21,55.28
SDA: length 27.2
  Top Layer w0.254: 46.42,40.9 43.91,40.9 39.75,45.06 39.75,60.84 37.63,62.96
$1N1189: length 5.1
  Top Layer w0.254: 28.77,76.67 28.77,75.24 28.99,75.03 30.46,75.03 30.78,74.72 30.78,73.3
$1N2750: length 49.2
  Top Layer w0.254: 19.02,65.98 16.65,63.62 16.65,59.98 14.86,58.19 13.01,58.19 12.27,58.93 12.27,71.73 11.38,72.62 6.17,72.62 3.33,69.78
  Bottom Layer w0.254: 3.43,82.47 4.48,81.41 4.48,71.09 3.27,69.88
$1N12006: length 37.1
  Top Layer w0.152: 86.47,11.17 86.47,11.38 85.15,12.7 85.15,17.85 79.83,23.18 79.83,25.07 80.46,25.7 84.18,25.7 85.04,24.83 85.04,23.57 86.56,22.06 90.25,22.06 90.32,21.99 90.34,21.99 92.86,19.46 92.86,17.65 94.28,16.22
$1N12011: length 17.5
  Top Layer w0.152: 81.33,36.6 82.91,38.18 82.91,38.26 84.33,38.26 85.04,37.55 85.04,35.82 87.85,33.02 90.53,33.02 92.16,31.39 94.28,31.39
$1N12464: length 44.4
  Top Layer w0.152: 94.19,44.26 91.93,46.52 91.93,49.22 89.94,51.21 84.41,51.21 82.54,53.08 82.54,55.14 81.7,55.98 80.79,55.98 80.1,55.28 80.1,53.8 84.78,49.12 84.78,45.59 87.59,42.78 87.59,41.12 87,40.54 84.05,40.54 83.77,40.82 83.77,41.73
$1N12467: length 36.5
  Top Layer w0.152: 94.17,46.7 92.5,48.37 92.5,49.46 88.94,53.01 86.33,53.01 85.01,54.33 85.01,55.49 84.24,56.26 80.68,56.26 79.82,55.4 79.82,53.68 84.28,49.22 84.28,43.75 86.38,41.64
$1N12470: length 17.3
  Top Layer w0.152: 81.11,67.13 82.58,68.6 84.37,68.6 85.06,67.92 85.06,66.37 87.81,63.62 91.07,63.62 92.52,62.18 94.27,62.18
$1N12479: length 36.6
  Top Layer w0.152: 86.42,72.03 84.21,74.24 84.21,79.51 79.79,83.93 79.79,85.93 80.58,86.72 84.58,86.72 85,86.3 85,84.73 86.27,83.46 89.06,83.46 94.11,78.4 94.11,77.46
$1N12482: length 43.9
  Top Layer w0.152: 83.72,72.02 84.66,71.07 87.18,71.07 87.66,71.55 87.66,73.33 84.5,76.49 84.5,79.7 80.07,84.14 80.07,85.82 80.69,86.44 81.98,86.44 82.5,85.92 82.5,84.23 83.85,82.89 88.82,82.89 92.62,79.09 92.62,76.06 93.72,74.96 94.25,74.96
$1N12485: length 17.3
  Top Layer w0.152: 94.43,92.77 92.17,92.77 90.86,94.08 87.62,94.08 85.11,96.6 85.11,98.3 84.48,98.93 82.74,98.93 81.32,97.51
$1N12491: length 13.2
  Top Layer w0.152: 83.79,97.51 87.51,93.8 90.74,93.8 94.06,90.48
$1N18211: length 9.2
  Top Layer w0.254: 13.78,87.8 13.78,87.13 14.93,85.97 16.37,85.97 16.86,85.48 16.9,85.52 18.51,85.52 19.04,84.99 19.04,84.22 18.2,83.38 17.85,83.38
$1N18215: length 17.1
  Top Layer w0.254: 17.67,84.64 16.3,84.64 15.43,85.52 13.46,85.52 12.62,84.67 12.62,75.16 13.88,73.9
$1N18221: length 28
  Top Layer w0.254: 13.78,59.96 13.32,60.42 13.32,71.76 14.93,73.37 14.93,74.78 13,76.71 13,81.34 13.99,82.32 17.53,82.32
$1N18270: length 8
  Top Layer w0.152: 19.05,78.72 21.34,81.01 21.34,81.73 21.78,82.16 21.78,84.43 22.17,84.82 22.78,84.82
$1N18397: length 3.8
  Top Layer w0.152: 22.26,82.24 21.62,81.61 21.62,78.66
$1N20798: length 8.5
  Top Layer w0.254: 31.14,76.82 32.35,75.61 32.35,71.24 34.09,69.5
$1N136278: length 2.7
  Top Layer w0.254: 48.11,76.91 50.69,76.91 50.74,76.85
$1N136334: length 2.7
  Top Layer w0.254: 53.27,76.96 55.85,76.96 55.95,76.85
$1N146581: length 112.9
  Top Layer w0.254: 21.15,72.48 24.95,76.27 24.95,78.12 25.74,78.91 27.1,78.91 30,81.81 30,87.26 30.33,87.59 31.91,87.59 32.22,87.28 32.22,84.05 34.1,82.17 39.85,82.17 44.48,86.81 ; 44.59,86.96 44.59,88.23 44.43,88.38 ; 19.05,67.04 20.23,67.04 21.28,65.98 ; 19.05,67.04 19.05,69.09 ; 19.05,67.04 17.54,67.04 16.17,65.67 16.17,60.05 14.7,58.58 13.17,58.58 12.66,59.09 12.66,74.58 12.21,75.02 12.21,84.82 12.49,85.09 12.49,89.6 11.63,90.46 11.63,92.38 10.92,93.09 9.39,93.09 8.85,92.56 8.85,84.15 7.22,82.52 5.75,82.52 ; 19.13,69.32 21.42,71.61 21.42,72.32
$1N147646: length 17.6
  Top Layer w0.254: 53.32,59.11 55.74,59.11 55.85,59 ; 31.2,86.04 31.09,85.93 31.09,82.34 27.35,78.6 27.35,74.82 25.77,73.24
$1N147668: length 2.3
  Top Layer w0.254: 53.48,61.79 55.69,61.79 55.74,61.74
$1N147689: length 2.6
  Top Layer w0.254: 53.48,64.16 55.9,64.16 56.01,64.06
$1N148332: length 30.3
  Top Layer w0.254: 5.71,47.11 12.66,54.06 12.66,54.53 8.47,58.72 8.47,62.51 6.1,64.88 5.71,64.88 ; 13.05,54.53 13.33,54.25 18.15,54.25 19.05,53.34
$1N148463: length 14.2
  Top Layer w0.254: 18.9,47.03 16.61,47.03 14.08,44.5 5.71,44.5
$1N149088: length 27.9
  Top Layer w0.254: 21.62,75.66 25.26,79.29 26.94,79.29 29.62,81.97 29.62,87.42 30.17,87.98 32.07,87.98 32.61,87.44 32.61,84.21 33.58,83.24 37.37,83.24
$1N149106: length 2.5
  Top Layer w0.254: 53.27,79.43 55.74,79.43
$1N151576: length 38.6
  Top Layer w2.032: 69.48,12.27 68.69,12.27 61.42,5 61.42,3.58 63.68,1.32 80.17,1.32 83.22,4.37 83.22,6.47
$1N152627: length 10.1
  Top Layer w0.254: 7.4,1.89 8.98,3.47 15.25,3.47 16.35,4.58
$1N152652: length 9.6
  Bottom Layer w0.254: 7.44,4.67 7.91,4.67 9.17,3.41 16.11,3.41 16.38,3.15
$1N152720: length 20
  Top Layer w0.254: 9.98,0.47 3.77,0.47 3.24,1 3.24,3.05 4.88,4.68 ; 9.98,0.47 15.51,0.47 16.56,1.52 ; 9.98,0.47 9.98,2.1
$1N154211: length 2.5
  Top Layer w0.254: 53.22,74.33 55.74,74.33
$1N154363: length 18
  Top Layer w0.254: 6.06,87.73 8.47,90.13 8.47,92.72 9.23,93.48 11.08,93.48 12.02,92.54 12.02,90.62 13.43,89.2 14.32,89.2 16.38,87.14
$1N155116: length 2.5
  Top Layer w0.254: 55.85,71.8 55.8,71.75 53.32,71.75
$1N156415: length 23.6
  Top Layer w0.254: 74.92,61.69 73.21,61.69 71.86,63.05 68.39,63.05 67.27,61.93 ; 74.92,59.07 72.86,57.01 69.89,57.01 69.56,56.69 69.56,55.17 69.98,54.74 74.83,54.74 75.27,54.3 75.27,53.36
$1N156473: length 5.8
  Top Layer w0.254: 55.8,69.27 55.74,69.22 53.43,69.22 ; 74.97,67.77 74.97,64.4
$1N156685: length 5.6
  Top Layer w0.254: 67.26,53.24 67.26,57.47 66.3,58.43
$1N167301: length 17.6
  Top Layer w0.152: 88,90.83 88,86.67 86.26,84.93
  Top Layer w0.61: 87.9,90.94 88,90.83 90.53,88.3 95.37,88.3 96.74,89.67 96.74,90.2
$1N167305: length 22.1
  Top Layer w0.152: 87.69,80.09 86.05,80.09 81.16,84.99
  Top Layer w0.61: 96.74,75.03 96.74,74.09 95.9,73.24 91.21,73.24 88.05,76.4 88.05,78.67
$1N168063: length 39.4
  Top Layer w0.254: 76.2,55.91 76.19,55.92 71.58,55.92 ; 71.99,63.52 66.16,63.52 65.92,63.77 65.92,65.63 66.23,65.94 69,65.94 70.79,67.73 ; 71.99,63.52 72.03,63.52 72.97,62.57 76.02,62.57 76.27,62.33 76.27,51.5 75.67,50.91 73,50.91 72.72,51.19 72.72,52.66
$1N168112: length 31
  Top Layer w0.254: 71.33,61.75 73.11,59.98 73.11,58.13 72.38,57.4 69.73,57.4 69.18,56.85 69.18,55 69.82,54.36 73.39,54.36 74,53.75 74,52.58 ; 67.28,67.44 67.28,66.71 66.9,66.33 66.07,66.33 65.53,65.79 65.53,61.05 66.02,60.56 69.88,60.56 71.05,61.73
$1N168177: length 6.7
  Top Layer w0.254: 68.29,57.45 69.23,57.45 69.57,57.79 70.48,57.79 71.12,58.43 71.12,59.16 ; 58.21,6.8 58.21,7.99 59.27,9.05
$1N173930: length 2.8
  Top Layer w0.254: 55.85,66.69 55.8,66.74 53.11,66.74
$1N179557: length 43.5
  Top Layer w0.152: 83.78,11.01 83.78,10.4 83.93,10.25 87.42,10.25 87.57,10.4 87.57,11.96 85.44,14.09 85.44,17.97 80.15,23.26 80.15,24.98 80.58,25.42 81.7,25.42 82.44,24.68 82.44,23.25 84.33,21.36 88.99,21.36 92.15,18.19 92.15,15.91 94.28,13.78
$1N179563: length 22.2
  Top Layer w0.152: 86.95,17.06 86.95,18.01 81.21,23.75
  Top Layer w0.61: 87.95,17.69 87.95,15.8 91.54,12.2 95.89,12.2 96.74,13.06 96.74,13.69
$1N179570: length 18.5
  Top Layer w0.152: 88.26,60.55 88.26,56.39 86.32,54.44
  Top Layer w0.61: 87.9,60.92 88.26,60.55 90.84,57.97 96.32,57.97 96.9,58.55 96.9,59.71
$1N179577: length 20
  Top Layer w0.152: 87.16,48.06 81.37,53.85 81.37,54.44
  Top Layer w0.61: 96.74,44.23 96.74,43.37 96.16,42.8 91.6,42.8 88.05,46.34
$1N179584: length 17.3
  Top Layer w0.152: 88.16,30.22 88.16,25.59 86.63,24.06
  Top Layer w0.61: 88.16,29.85 90.74,27.27 95.27,27.27 96.64,28.64 96.64,29.06
$1N179588: length 13.2
  Top Layer w0.152: 84.02,36.44 87.73,32.73 90.41,32.73 94.05,29.1 94.21,29.1
$1N179591: length 13.7
  Top Layer w0.152: 94.17,59.49 94.17,60.12 90.96,63.34 87.69,63.34 83.95,67.07

## Text on the board
Top Silkscreen Layer: LED6 | SX1 | SX2 | DCC | Leer | LNet1 | LNet2 | CANRX | CANTX | noLogo | CAN | SX | DMX | Power | LNet
